# EAGLE design current_driver (EAGLE 8.3.2)
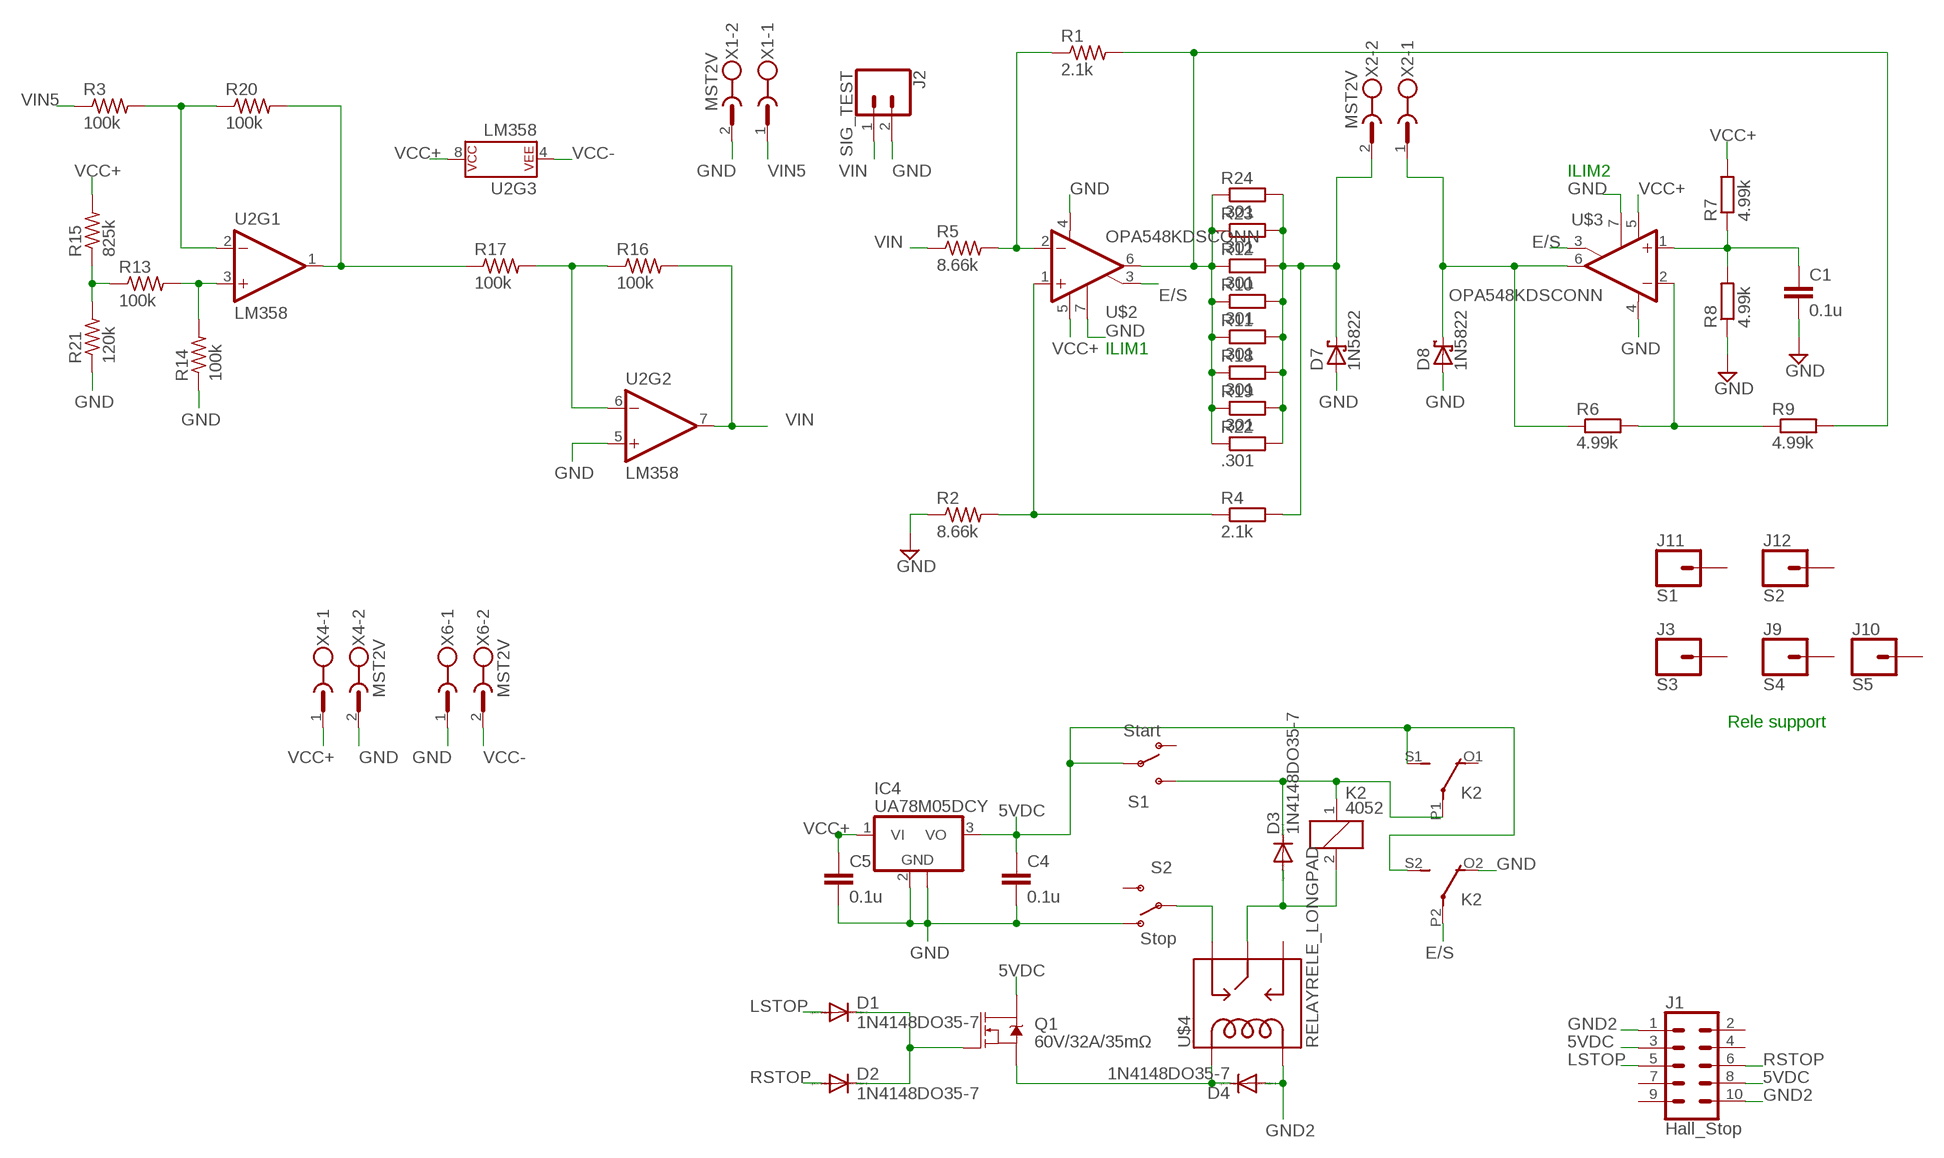
[diagram p0: schematic, sheet 1]

## Parts
C1  0.1u  C-EUC2012  [C2012]
C4  0.1u  C-EUC2012  [C2012]
C5  0.1u  C-EUC2012  [C2012]
D1  1N4148DO35-7  [DO35-7]
D2  1N4148DO35-7  [DO35-7]
D3  1N4148DO35-7  [DO35-7]
D4  1N4148DO35-7  [DO35-7]
D7  1N5822  SCHOTTKY-DIODEF126Z12  [F126Z12]
D8  1N5822  SCHOTTKY-DIODEF126Z12  [F126Z12]
IC4  UA78M05DCY  [SOT223]
J1  Hall_Stop  CONN_05X2SHD_LOCK  [2X5-SHROUDED_LOCK]
J2  SIG_TEST  CONN_02LOCK_LONGPADS  [1X02_LOCK_LONGPADS]
J3  S3  CONN_01PTH_LONGPAD  [1X01_LONGPAD]
J9  S4  CONN_01PTH_LONGPAD  [1X01_LONGPAD]
J10  S5  CONN_01PTH_LONGPAD  [1X01_LONGPAD]
J11  S1  CONN_01PTH_LONGPAD  [1X01_LONGPAD]
J12  S2  CONN_01PTH_LONGPAD  [1X01_LONGPAD]
K2  4052  [F4052]
Q1  60V/32A/35mΩ  MOSFET-NCH-FQP30N06L  [TO220V]
R1  2.1k  R-US_R0805  [R0805]
R2  8.66k  R-US_R0805  [R0805]
R3  100k  R-US_R0805  [R0805]
R4  2.1k  R-EU_R0805  [R0805]
R5  8.66k  R-US_R0805  [R0805]
R6  4.99k  R-EU_R0805  [R0805]
R7  4.99k  R-EU_R0805  [R0805]
R8  4.99k  R-EU_R0805  [R0805]
R9  4.99k  R-EU_R0805  [R0805]
R10  .301  R-EU_M1206  [M1206]
R11  .301  R-EU_M1206  [M1206]
R12  .301  R-EU_M1206  [M1206]
R13  100k  R-US_R0805  [R0805]
R14  100k  R-US_R0805  [R0805]
R15  825k  R-US_R0805  [R0805]
R16  100k  R-US_R0805  [R0805]
R17  100k  R-US_R0805  [R0805]
R18  .301  R-EU_M1206  [M1206]
R19  .301  R-EU_M1206  [M1206]
R20  100k  R-US_R0805  [R0805]
R21  120k  R-US_R0805  [R0805]
R22  .301  R-EU_M1206  [M1206]
R23  .301  R-EU_M1206  [M1206]
R24  .301  R-EU_M1206  [M1206]
S1  Start  SWITCH-SPDTSMD  [SWITCH_SPDT_SMD]
S2  Stop  SWITCH-SPDTSMD  [SWITCH_SPDT_SMD]
U2  LM358  LM358DIP08_LONGPAD  [DIP08_LONGPAD]
U$2  OPA548KDSCONN  [OPA548KDSCONN]
U$3  OPA548KDSCONN  [OPA548KDSCONN]
U$4  RELAYRELE_LONGPAD  [RELE_LONGPAD]
X1  MST2V  [MSTBV2]
X2  MST2V  [MSTBV2]
X4  MST2V  [MSTBV2]
X6  MST2V  [MSTBV2]

## Nets
5VDC: C4.1 IC4.3(VO) J1.3 J1.8 K2.S1(2:S) K2.S2(3:S) Q1.2(D) S1.2(P)
E/S: K2.P2(3:P) U$2.3(ILIM) U$3.3(ILIM)
GND: C1.2 C4.2 C5.2 D7.A D8.A IC4.2(GND) IC4.4(GND) J2.2 K2.O2(3:O) R2.1 R8.1 R14.1 R21.1 S2.1(O) U2.5(+IN) U$2.4(V-) U$2.7(E/S) U$3.4(V-) U$3.7(E/S) X1.2 X4.2 X6.1
GND2: D4.A J1.1 J1.10 U$4.COIL0
LSTOP: D1.A J1.5
N$2: R1.1 R5.2 U$2.2(-IN)
N$3: D7.C R4.2 R10.2 R11.2 R12.2 R18.2 R19.2 R22.2 R23.2 R24.2 X2.2
N$4: R2.2 R4.1 U$2.1(+IN)
N$5: D8.C R6.1 U$3.6(OUT) X2.1
N$6: R6.2 R9.1 U$3.2(-IN)
N$7: C1.1 R7.1 R8.2 U$3.1(+IN)
N$8: D3.C K2.1 K2.P1(2:P) S1.3(S)
N$9: D4.C Q1.3(S) U$4.COIL1
N$10: D3.A K2.2 U$4.SWCOMMON
N$11: S2.2(P) U$4.SWCLOSED(SWCLOSE)
N$12: R17.1 R20.2 U2.1(OUT)
N$13: R3.2 R20.1 U2.2(-IN)
N$14: R13.2 R14.2 U2.3(+IN)
N$15: R13.1 R15.1 R21.2
N$16: D1.C D2.C Q1.1(G)
N$17: R16.1 R17.2 U2.6(-IN)
N$19: R1.2 R9.2 R10.1 R11.1 R12.1 R18.1 R19.1 R22.1 R23.1 R24.1 U$2.6(OUT)
RSTOP: D2.A J1.6
VCC+: C5.1 IC4.1(VI) R7.2 R15.2 U2.8(P$V+) U$2.5(V+) U$3.5(V+) X4.1
VCC-: U2.4(P$V-) X6.2
VIN: J2.1 R5.1 R16.2 U2.7(OUT)
VIN5: R3.1 X1.1
Unconnected: J1.2 J1.4 J1.7 J1.9 J3.1 J9.1 J10.1 J11.1 J12.1 K2.O1(2:O) S1.1(O) S2.3(S) U$4.SWOPEN

## Notes on the sheet
- ILIM2
- ILIM1
- Rele support

## Library data of the parts
C1 C4 C5 = rcl:C-EU: CAPACITOR, European symbol
D1-D4 = diode:1N4148: DIODE high speed (Philips)
D7 D8 = diode:SCHOTTKY-DIODE: Schottky Diode
IC4 = linear:UA78M*: POSITIVE-VOLTAGE REGULATORS Source: http://focus.ti.com/lit/ds/symlink/ua78m33.pdf
J1 = SparkFun-Connectors:CONN_05X2: Multi connection point. Often used as Generic Header-pin footprint for 0.1 inch spaced/style header connections For AVR SPI programming port, see special device with nice symbol: "AVR_SPI_PROG_5x2.dev" You can populate with any combo of single row headers, but if you'd like an exact match, check these: 2x5 AVR ICSP Male Header <https://www.sparkfun.com/products/778> (PRT-00778) 2x5 Pin Shrouded Header <https://www.sparkfun.com/products/8506> (PRT-08506) On any of the 0.1 inch spaced packages, you can populate with these: Break Away Headers - Straight <https://www.sparkfun.com/products/116> (PRT-00116) Break Away Male Headers - Right Angle <https://www.sparkfun.com/products/553> (PRT-00553) Female Headers <https://www.sparkfun.com/products/115> (PRT-00115) Break Away Headers - Machine Pin <https://www.sparkfun.com/products/117> (PRT-00117) Break Away Female Headers - Swiss Machine Pin <https://www.sparkfun.com/products/743> (PRT-00743) Special note: the shrouded connector mates well with our 5x2 ribbon cables: 2x5 Pin IDC Ribbon Cable <https://www.sparkfun.com/products/8535> (PRT-08535); PROD_ID: CONN-08671; SF_ID: PRT-08506
J2 = SparkFun-Connectors:CONN_02: Multi connection point. Often used as Generic Header-pin footprint for 0.1 inch spaced/style header connections On any of the 0.1 inch spaced packages, you can populate with these: Break Away Headers - Straight <https://www.sparkfun.com/products/116> (PRT-00116) Break Away Male Headers - Right Angle <https://www.sparkfun.com/products/553> (PRT-00553) Female Headers <https://www.sparkfun.com/products/115> (PRT-00115) Break Away Headers - Machine Pin <https://www.sparkfun.com/products/117> (PRT-00117) Break Away Female Headers - Swiss Machine Pin <https://www.sparkfun.com/products/743> (PRT-00743) For SCREWTERMINALS and SPRING TERMINALS visit here: Screw Terimnals on SparkFun.com <https://www.sparkfun.com/search/results?term=Screw+Terminals> (5mm/3.5mm/2.54mm spacing) This device is also useful as a general connection point to wire up your design to another part of your project. Our various solder wires solder well into these plated through hole pads. Hook-Up Wire - Assortment (Stranded, 22 AWG) <https://www.sparkfun.com/products/11375> (PRT-11375) Hook-Up Wire - Assortment (Solid Core, 22 AWG) <https://www.sparkfun.com/products/11367> (PRT-11367) View the entire wire category on our website here <https://www.sparkfun.com/categories/141> Special notes: Molex polarized connector foot print use with: PRT-08233 with associated crimp pins and housings. 2.54_SCREWTERM for use with PRT-10571. 3.5mm Screw Terminal footprints for PRT-08084 5mm Screw Terminal footprints for use with PRT-08432
J3 J9-J12 = SparkFun-Connectors:CONN_01: Single connection point. Often used as Generic Header-pin footprint for 0.1 inch spaced/style header connections On any of the 0.1 inch spaced packages, you can populate with these: Break Away Headers - Straight <https://www.sparkfun.com/products/116> (PRT-00116) Break Away Male Headers - Right Angle <https://www.sparkfun.com/products/553> (PRT-00553) Female Headers <https://www.sparkfun.com/products/115> (PRT-00115) Break Away Headers - Machine Pin <https://www.sparkfun.com/products/117> (PRT-00117) Break Away Female Headers - Swiss Machine Pin <https://www.sparkfun.com/products/743> (PRT-00743) This device is also useful as a general connection point to wire up your design to another part of your project. Our various solder wires solder well into these plated through hole pads. Hook-Up Wire - Assortment (Stranded, 22 AWG) <https://www.sparkfun.com/products/11375> (PRT-11375) Hook-Up Wire - Assortment (Solid Core, 22 AWG) <https://www.sparkfun.com/products/11367> (PRT-11367) View the entire wire category on our website here <https://www.sparkfun.com/categories/141> Special notes: SMTSO-256-ET is a "flush mount" nut for a 4-40 screw. We mostly use this on specialty testbeds; it is a nice way to connect hardware to your PCB at an adjustable hieght. Also note, the SNAP packages are for using a snappable style connector. We sell a baggie of snaps and they are also used on two LilyPad designs: Snap Assortment - 30 pack (male and female) <https://www.sparkfun.com/products/11347> (DEV-11347) LilyPad Arduino SimpleSnap <https://www.sparkfun.com/products/10941> (DEV-10941) LilyPad SimpleSnap Protoboard <https://www.sparkfun.com/products/10940> (DEV-10940)
K2 = relay:4052: RELAY 2 x switch, Finder; OC_FARNELL: unknown; OC_NEWARK: unknown
Q1 = SparkFun-DiscreteSemi:MOSFET-NCH: N-channel MOSFETs Voltage controlled devices that allow control of high current outputs. SparkFun Products: SparkFun OpenScale <https://www.sparkfun.com/products/13261> SparkFun Digital Sandbox <https://www.sparkfun.com/products/12651> SparkFun Monster Moto Shield <https://www.sparkfun.com/products/10182> SparkFun MOSFET Power Controller <https://www.sparkfun.com/products/11214>; PROD_ID: TRANS-10060
R1-R3 R5 R13-R17 R20 R21 = resistor:R-US_: RESISTOR, American symbol
R4 R6-R9 = resistor:R-EU_: RESISTOR, European symbol
R10-R12 R18 R19 R22-R24 = rcl:R-EU_: RESISTOR, European symbol
S1 S2 = SparkFun-Retired:SWITCH-SPDT: SPDT Switch Simple slide switch, Spark Fun Electronics SKU : COM-00102 DPDT SMT slide switch, AYZ0202, SWCH-08179
U2 = SparkFun-IC-Amplifiers:LM358: LM358 Jellybean op-amp Datasheet <http://www.sparkfun.com/datasheets/Components/General/LM358.pdf> SparkFun Products Op-Amp (Thru-Hole) - LM358 <https://www.sparkfun.com/products/9456> (COM-09456)
U$2 U$3 = opa548-kds:OPA548KDSCONN: OPA548 KDS03 AND KDS04 CONNECTORS
U$4 = SRD-05VDC-SL-C:RELAY: SPDT relay (COM-00101)
X1 X2 X4 X6 = con-phoenix-508:MST2V: PHOENIX; OC_FARNELL: unknown; OC_NEWARK: unknown

## Board
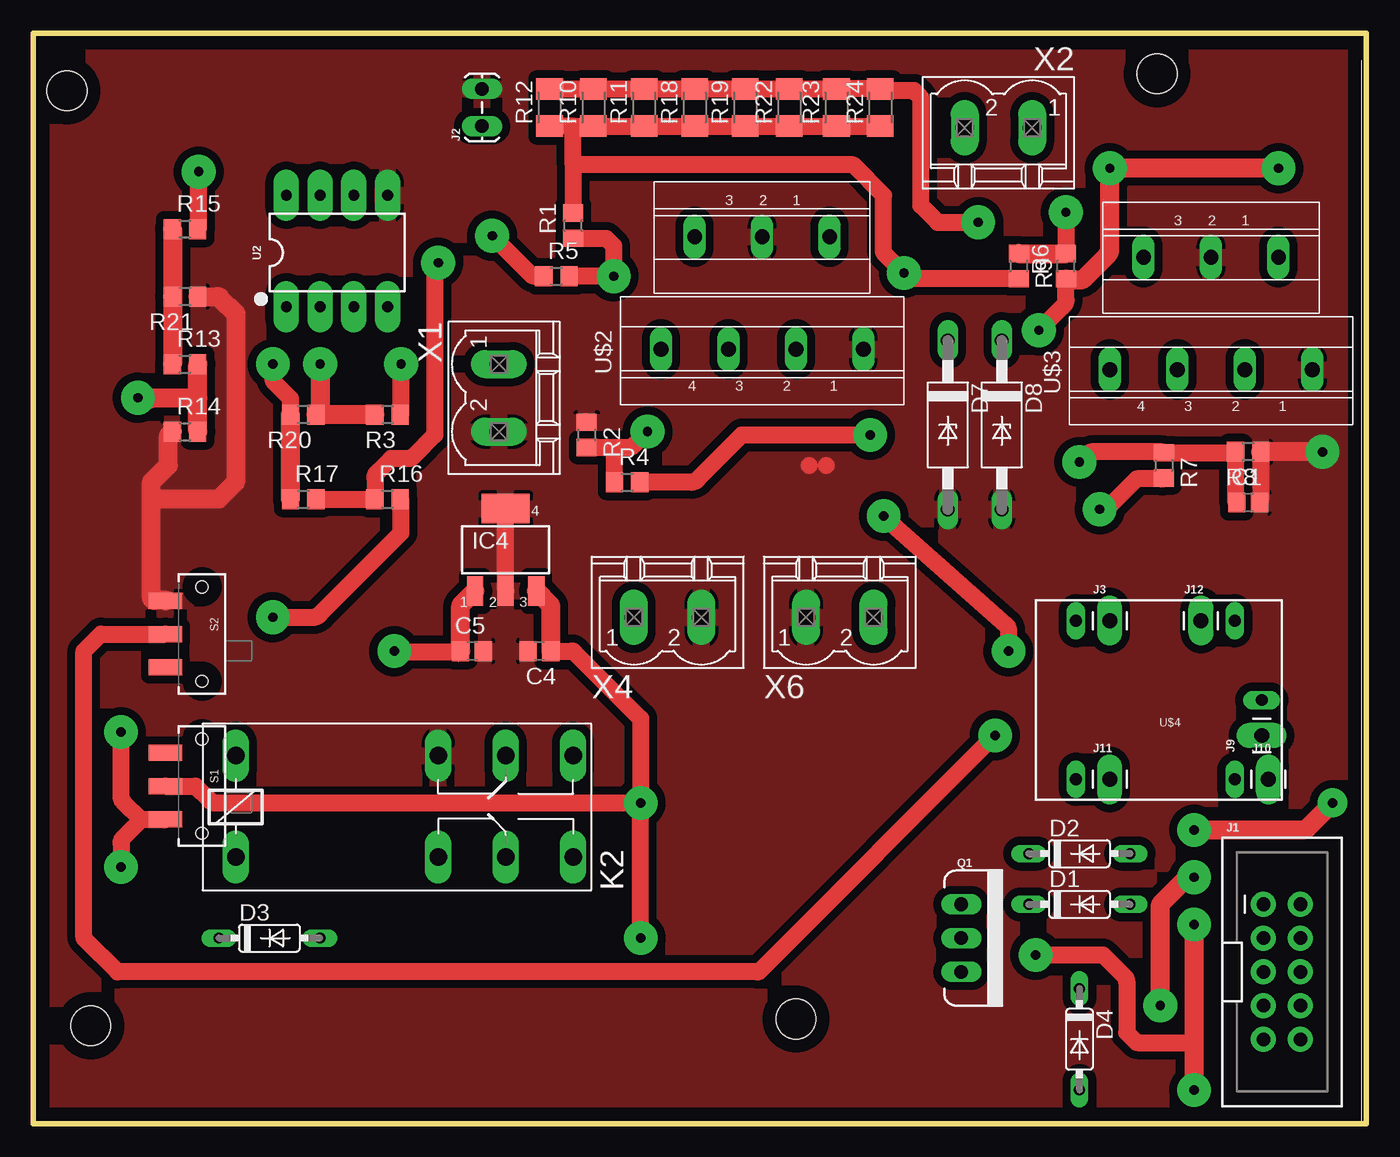
[diagram p1: board, top side]
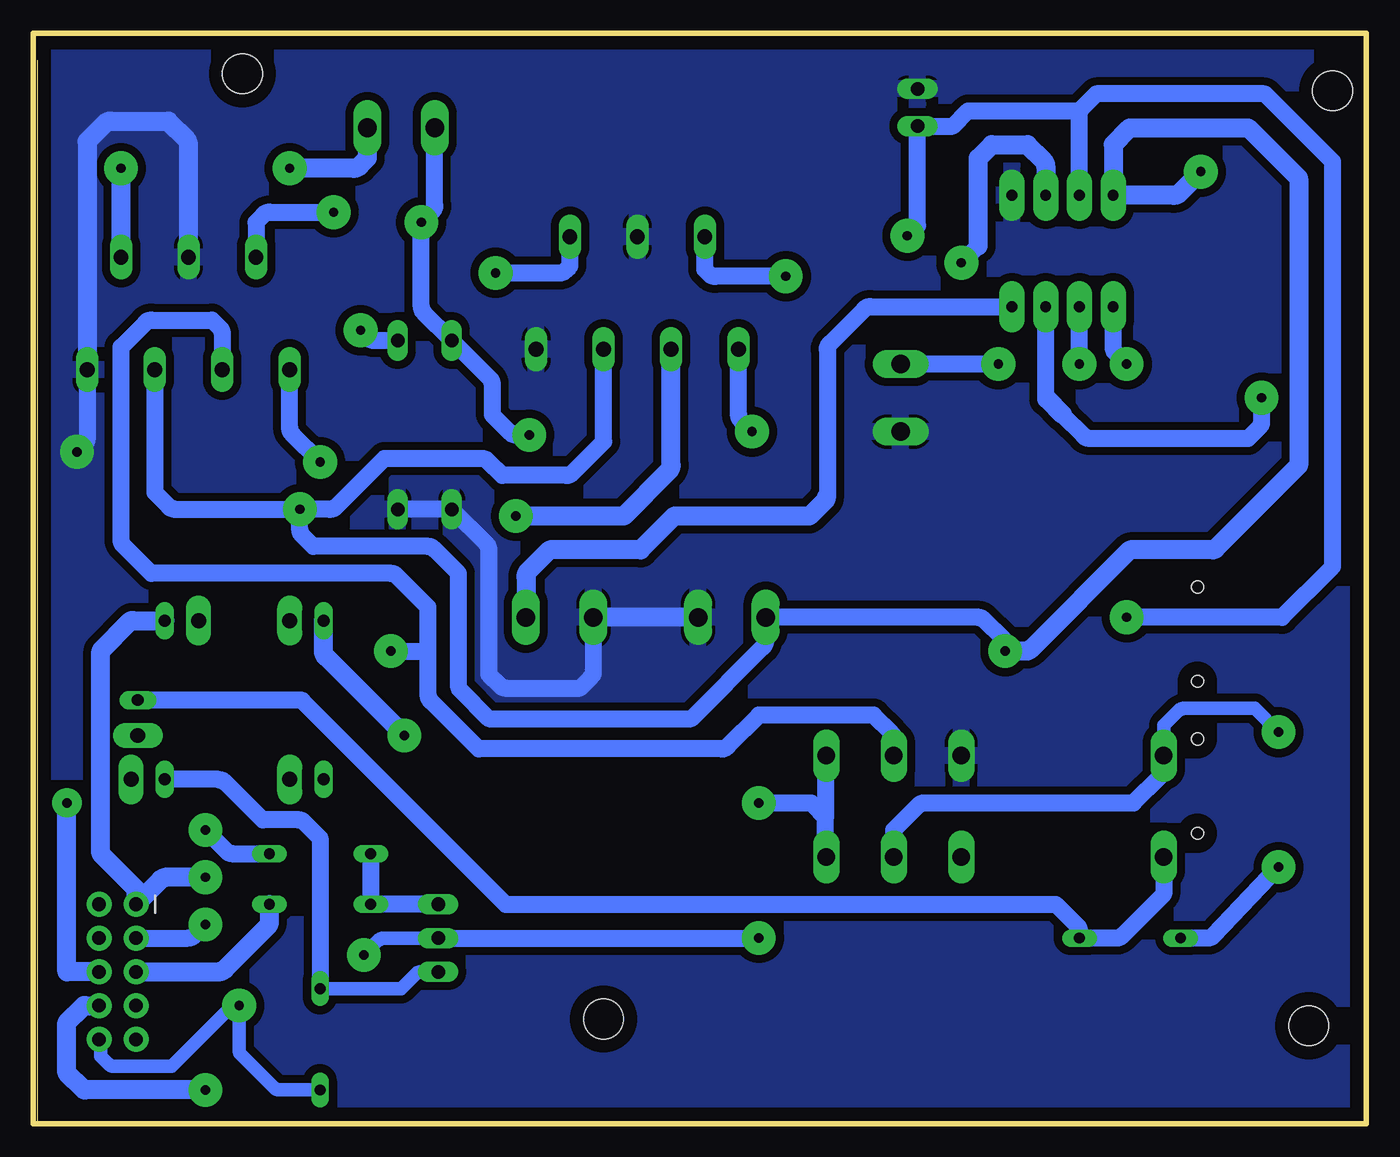
[diagram p2: board, bottom side, seen from below]

Size 100.33 x 82.04 mm. Coordinates in mm from the lower left corner, seen from the top.
Outline: 0,0 100,0 100,80
Outline: 0,80 0,0
Outline: 0,0 0,82.04 100.33,82.04 100.33,0 0,0
Copper layers (1*16): Top 0.035mm / dielectric 1.5mm / Bottom 0.035mm
Design rules "default": minimum track width 10mil, minimum drill 24mil, track to track 8mil, track to pad 8mil, pad to pad 8mil, via to via 8mil, smd to smd 8mil, copper to edge 40mil, drill to drill 8mil, minimum pad ring 10mil, minimum via ring 8mil, stop-mask expansion 4mil, vias tented up to drill 0mil, thermal gap 10mil
Holes 3 mm at 2.54,77.72 84.58,78.99 4.32,7.37 57.4,7.87

### Footprints (pad centres in the part's own frame; a part is rotated, then mirrored left to right if it is on the bottom)
C2012 = smd 1.3 x 1.5: 1 -0.85,0; 2 0.85,0
DO35-7 = drill 0.813 long: A 3.81,0; C -3.81,0
F126Z12 = drill 1.016 long: A 6.35,0; C -6.35,0
SOT223 = smd 1.219 x 2.235: 1 -2.311,-3.099; 2 0,-3.099; 3 2.311,-3.099 | smd 3.6 x 2.2: 4 0,3.099
2X5-SHROUDED_LOCK = drill 1.016 pad 1.88: 1 -1.397,5.08; 2 1.397,5.08; 3 -1.397,2.54; 4 1.397,2.54; 5 -1.397,0; 6 1.397,0; 7 -1.397,-2.54; 8 1.397,-2.54; 9 -1.397,-5.08; 10 1.397,-5.08
1X02_LOCK_LONGPADS = drill 1.016 long: 1 -0.127,0; 2 2.667,0
1X01_LONGPAD = drill 1.118 pad 1.88 long: 1 0,0
F4052 = drill 1.321 long: 1 -3.81,3.81; 2 -3.81,-3.81; O1 11.43,-3.81; O2 11.43,3.81; P1 16.51,-3.81; P2 16.51,3.81; S1 21.59,-3.81; S2 21.59,3.81
TO220V = drill 1.016 long: 1 -2.54,0; 2 0,0; 3 2.54,0
R0805 = smd 1.3 x 1.5: 1 -0.95,0; 2 0.95,0
M1206 = smd 1.6 x 2: 1 -1.4,0; 2 1.4,0
SWITCH_SPDT_SMD = smd 1.2 x 2.5: 1 -2.5,-2.75; 2 0,-2.75; 3 2.5,-2.75 | hole 0.9: -3.55,0; 3.55,0
DIP08_LONGPAD = drill 0.8 pad 1.93 long: 1 -3.81,-4.064; 2 -1.27,-4.064; 3 1.27,-4.064; 4 3.81,-4.064; 5 3.81,4.318; 6 1.27,4.318; 7 -1.27,4.318; 8 -3.81,4.318
OPA548KDSCONN = drill 1.118 pad 1.626 long: 1 -7.62,-1.686; 2 -5.08,6.78; 3 -2.54,-1.686; 4 0,6.78; 5 2.54,-1.686; 6 5.08,6.78; 7 7.62,-1.686
RELE_LONGPAD = drill 0.9 long: COIL0 -5.334,-6.096; COIL1 -5.334,5.842; SWCLOSED 6.604,-6.096; SWCOMMON -7.366,-0.127; SWOPEN 6.604,5.842
MSTBV2 = drill 1.397 long: 1 -2.54,0; 2 2.54,0

### Placement (x,y rotation side)
C1  91.44,46.74 0 top
C4  38.1,35.56 180 top
C5  33.02,35.56 0 top
D1  78.74,16.51 0 top
D2  78.74,20.32 0 top
D3  17.78,13.97 0 top
D4  78.74,6.35 270 top
D7  68.83,52.58 270 top
D8  72.9,52.58 270 top
IC4  35.56,43.18 0 top
J1  93.98,11.43 0 top
J2  33.78,75.18 90 top
J3  81.03,37.85 0 top
J9  92.46,29.21 90 top
J10  92.96,25.91 0 top
J11  81.03,25.91 0 top
J12  87.88,37.85 0 top
K2  19.05,23.88 0 top
Q1  69.85,13.97 270 top
R1  40.64,67.56 90 top
R2  41.66,51.82 270 top
R3  26.67,53.34 180 top
R4  44.7,48.26 0 top
R5  39.37,63.75 0 top
R6  77.72,64.52 90 top
R7  85.09,49.53 270 top
R8  91.44,50.55 180 top
R9  74.17,64.52 270 top
R10  42.16,76.45 90 top
R11  45.97,76.45 90 top
R12  38.86,76.45 90 top
R13  11.43,57.15 0 top
R14  11.43,52.07 0 top
R15  11.43,67.31 0 top
R16  26.67,46.99 0 top
R17  20.32,46.99 0 top
R18  49.78,76.45 90 top
R19  53.59,76.45 90 top
R20  20.32,53.34 180 top
R21  11.43,62.23 180 top
R22  56.9,76.45 90 top
R23  60.45,76.45 90 top
R24  63.75,76.45 90 top
S1  12.7,25.4 270 top
S2  12.7,36.83 270 top
U2  22.86,65.53 0 top
U$2  54.86,59.94 0 top
U$3  88.65,58.42 0 top
U$4  85.09,31.75 180 top
X1  35.05,54.61 270 top
X2  72.64,74.93 180 top
X4  47.75,38.1 0 top
X6  60.71,38.1 0 top

### Tracks (layer width: path | path; a pad name or v marks a point on that pad's centre or on a via)
5VDC  (via drill 0.7 pad 2.54)
  Top 1.27: C4.1 40.53,35.56 arc-45 40.71,35.49 45.72,30.48 v45.72,24.13 | v45.72,13.97 v45.72,24.13 | S1.2 12.19,25.4 13.28,24.32 arc45 13.72,24.13 v45.72,24.13 | 87.38,6.1 83.16,6.1 arc-45 82.98,6.17 82.3,6.86 82.3,10.66 arc45 82.11,11.11 80.52,12.7 v75.44,12.7
  Top 1.422: IC4.3 38.88,39.08 arc-45 38.95,38.9 C4.1 | v87.38,2.54 87.38,6.1 v87.38,14.99
  Bottom 1.016: Q1.2 73.91,13.97 arc-45 74.35,13.78 v75.44,12.7
  Bottom 1.27: v45.72,24.13 41.87,24.13 arc45 41.69,24.06 40.69,23.06 | Q1.2 v45.72,13.97 | K2.S2 arc-90 40.69,27.63 40.69,23.06 | K2.S1 arc90 40.69,20.12 40.69,23.06 | J1.3 88.66,13.97 arc-45 88.21,14.16 v87.38,14.99
  Bottom 1.422: v87.38,2.54 96.42,2.54 arc45 96.59,2.61 97.79,3.81 97.79,7.62 96.59,8.82 arc45 96.42,8.89 J1.8
E/S  (via drill 0.7 pad 2.54)
  Top 1.27: v73.41,35.56 73.41,37.08 arc45 73.22,37.52 v64.01,45.72
  Bottom 1.27: 70.61,35.56 70.61,32.27 arc-45 70.43,31.82 66.8,28.19 48.52,28.19 arc-45 48.07,28.38 45.72,30.73 37.08,30.73 35.75,29.4 arc45 35.56,28.95 K2.P2 | 70.61,35.56 70.61,38.86 72.97,41.22 arc-45 73.42,41.4 91.44,41.4 93.54,43.5 arc45 93.73,43.95 93.73,58.42 91.88,60.27 arc45 91.43,60.45 86.87,60.45 86.29,59.88 arc45 86.11,59.43 U$3.3 | v73.41,35.56 70.61,35.56
  Bottom 1.422: U$2.3 52.32,49.54 arc45 52.51,49.09 55.88,45.72 v64.01,45.72
GND  (via drill 0.7 pad 2.54)
  Top 1.27: R8.1 92.39,46.94 | IC4.2 IC4.4 | R2.1 41.59,52.83 | 58.42,49.53 arc-63 58.42,49.53 | 59.69,49.53 arc-63 59.69,49.53
  Top 1.422: S2.1 arc-45 10.05,39.37 9.14,39.37 arc-90 8.89,39.62 8.89,46.99 | 8.89,46.99 8.89,48.26 10.16,49.53 10.16,51.65 arc-45 10.23,51.82 R14.1 | R21.1 13.87,62.23 arc-45 14.04,62.16 15.24,60.96 15.24,48.37 arc-45 15.17,48.19 13.97,46.99 8.89,46.99 | v97.03,50.55 R8.1
  Bottom 1.27: X6.1 58.17,34.05 arc45 58.35,33.6 59.18,32.77 64.76,32.77 arc45 65.21,32.95 66.04,33.78 66.04,43.17 arc-45 66.23,43.62 D7.A D8.A | U$3.7 96.27,51.57 arc45 96.45,51.12 v97.03,50.55
  Bottom 1.422: U$3.7 96.27,73.91 94.93,75.25 arc45 94.48,75.44 90.17,75.44 88.83,74.1 arc45 88.65,73.65 U$3.4 | X4.2 X6.1
  pour Bottom (isolate 0.61): 0,81.79 100.33,81.79 100.33,0 0,0
  pour Top (isolate 0.61): 0,81.79 100.33,81.79 100.33,0 0,0
GND2  (via drill 0.7 pad 2.54)
  Top 1.422: v84.84,8.89 84.84,16.51 86.68,18.36 arc-45 87.13,18.54 v87.38,18.54
  Bottom 1.016: J1.10 arc45 95.25,6.04 95.25,5.08 94.67,4.5 arc-45 94.22,4.32 89.92,4.32 85.53,8.7 arc45 85.08,8.89 v84.84,8.89 84.84,5.6 arc-45 84.65,5.15 82.23,2.73 arc-45 81.78,2.54 D4.A
  Bottom 1.27: J1.1 92.31,16.51
  Bottom 1.422: v87.38,18.54 90.29,18.54 arc-45 90.74,18.36 J1.1 92.58,17.55 arc-45 92.66,17.73 95.25,20.32 95.25,35.56 93.01,37.8 arc45 92.83,37.87 arc-45 92.78,37.85 U$4.COIL0
LSTOP
  Bottom 1.422: J1.5 86.37,11.43 arc-45 85.92,11.62 82.74,14.8 arc-45 82.55,15.25 D1.A
N$2  (via drill 0.7 pad 2.54)
  Top 1.27: R5.2 v43.69,63.75 43.69,66.04 43.11,66.61 R1.1
  Bottom 1.27: v43.69,63.75 49.01,63.75 arc45 49.46,63.94 49.78,64.26 U$2.2
N$3  (via drill 0.7 pad 2.54)
  Top 1.27: v62.99,51.82 53.34,51.82 49.97,48.45 arc-45 49.52,48.26 R4.2 | v71.12,67.82 68.07,67.82 66.8,69.09 66.8,77.22 66.29,77.72 63.88,77.72 R24.2 R23.2 R22.2 R19.2 R18.2 R11.2 R10.2 R12.2
  Bottom 1.27: X2.2 70.1,69.1 arc45 70.29,68.65 v71.12,67.82 71.12,61.48 arc-45 70.93,61.03 D7.C 65.97,56.07 arc45 65.79,55.62 65.79,53.35 64.44,52 arc-45 63.99,51.82 v62.99,51.82
N$4  (via drill 0.7 pad 2.54)
  Top 1.27: 43.86,50.8 arc-45 43.68,50.87 | R4.1 43.75,50.7 arc45 43.68,50.87 | 43.68,50.87 43.18,50.87 | 43.18,50.87 R2.2 | v46.23,52.07 45.22,51.06 arc-45 44.77,50.87 43.18,50.87
  Bottom 1.27: v46.23,52.07 47.06,52.9 arc45 47.24,53.35 U$2.1
N$5  (via drill 0.7 pad 2.54)
  Top 1.27: v75.69,59.69 77.54,61.54 arc45 77.72,61.98 R6.1
  Top 1.422: v93.73,71.88 v81.03,71.88 81.03,65.8 arc-45 80.84,65.35 78.99,63.5 77.88,63.5 arc-45 R6.1
  Bottom 1.27: v75.69,59.69 75.12,59.11 arc-45 74.67,58.93 D8.C
  Bottom 1.422: U$3.6 v93.73,71.88 | X2.1 75.18,72.64 75.76,72.07 arc45 76.21,71.88 v81.03,71.88
N$6  (via drill 0.7 pad 2.54)
  Top 1.27: v77.72,68.58 R6.2
  Top 1.422: R9.1 R6.2
  Bottom 1.27: U$3.2 83.57,67.82 82.99,68.39 arc45 82.54,68.58 v77.72,68.58
N$7  (via drill 0.7 pad 2.54)
  Top 1.27: C1.1 90.56,46.76 arc-45 90.49,46.94 R8.2 arc-45 90.33,50.48 R7.1 arc45 84.93,50.55 79.77,50.55 arc45 79.32,50.36 v78.74,49.78
  Bottom 1.27: U$3.1 81.03,52.33 arc-45 80.84,51.88 v78.74,49.78
N$8  (via drill 0.7 pad 2.54)
  Top 1.27: S1.3 arc-45 9.85,22.86 8.13,22.86 | 8.13,22.86 6.79,24.2 arc-45 6.6,24.65 v6.6,29.46 | 8.13,22.86 6.79,21.52 arc45 6.6,21.07 v6.6,19.3
  Bottom 1.016: K2.1 15.24,29.97 14.16,31.06 arc45 13.71,31.24 8.38,31.24 v6.6,29.46
  Bottom 1.27: K2.P1 35.56,22.1 33.71,23.94 arc45 33.27,24.13 17.53,24.13 15.43,26.23 | 15.43,26.23 arc-45 15.24,26.68 | 15.24,26.68 K2.1 | v6.6,19.3 11.5,14.16 arc45 11.95,13.97 D3.C | 15.43,26.23 arc-45 15.24,26.68
N$9
  Bottom 1.016: Q1.3 71.11,11.43 arc-45 71.56,11.24 72.64,10.16 D4.C
  Bottom 1.27: U$4.COIL1 86.42,25.91 arc45 86.33,25.87 arc45 85.88,25.68 83.06,22.86 80.38,22.86 arc45 79.93,22.67 78.74,21.48 D4.C
N$10
  Bottom 1.27: K2.2 15.24,17.27 18.36,14.16 arc45 18.8,13.97 D3.A 21.59,14.47 arc-45 21.78,14.92 23.37,16.51 64.77,16.51 80.06,31.8 arc-45 80.23,31.87 arc-45 80.25,31.88 U$4.SWCOMMON
N$11  (via drill 0.7 pad 2.54)
  Top 1.27: S2.2 5.08,36.83 3.88,35.63 arc45 3.81,35.45 3.81,14.07 arc45 3.88,13.9 6.35,11.43 54.51,11.43 arc45 54.68,11.5 v72.39,29.21
  Bottom 1.422: v72.39,29.21 78.3,35.12 arc45 78.49,35.57 U$4.SWCLOSED
N$12  (via drill 0.7 pad 2.54)
  Top 1.27: R20.2 19.37,54.45 arc45 19.3,54.61 18.22,55.69 arc-45 18.03,56.14 v18.03,57.15
  Top 1.422: R17.1 R20.2
  Bottom 1.27: v18.03,57.15 18.86,57.98 arc45 19.05,58.43 U2.1
N$13  (via drill 0.7 pad 2.54)
  Top 1.422: R3.2 21.59,53.34 | v21.59,57.15 21.59,53.34 | 21.59,53.34 R20.1
  Bottom 1.27: v21.59,57.15 U2.2
N$14  (via drill 0.7 pad 2.54)
  Top 1.422: R14.2 12.38,54.61 | 12.38,54.61 R13.2 | v7.87,54.61 8.82,54.54 arc-45 8.99,54.61 12.38,54.61
  Bottom 1.27: 22.86,53.34 21.27,51.75 arc-45 20.82,51.56 8.89,51.56 8.06,52.39 arc-45 7.87,52.84 v7.87,54.61 | 24.06,54.54 arc45 24.13,54.72 U2.3
  Bottom 1.422: 24.06,54.54 22.86,53.34
N$15
  Top 1.422: R15.1 R21.2 R13.1
N$16
  Bottom 1.27: Q1.1 D1.C D2.C
N$17  (via drill 0.7 pad 2.54)
  Top 1.27: R17.2 R16.1 25.72,48.57 arc-45 25.91,49.02 26.92,50.04 28.18,50.04 arc45 28.63,50.22 30.23,51.82 30.23,64.25 arc-45 30.41,64.7 v30.48,64.77
  Bottom 1.27: v30.48,64.77 29.21,66.04
  Bottom 1.422: U2.6 24.13,72.02 arc-45 24.32,72.47 25.5,73.66 28.19,73.66 29.21,72.64 29.21,66.04
N$19  (via drill 0.7 pad 2.54)
  Top 1.27: 40.64,75.05 R12.1 | 40.64,75.05 R10.1 R11.1 R18.1 R19.1 R22.1 R23.1 R24.1 | 40.64,72.14 R1.2 | 40.64,72.14 40.64,75.05 | R9.2 65.97,63.57 v65.53,64.01 64.01,65.53 64.01,69.85 61.72,72.14 40.64,72.14
  Bottom 1.27: v65.53,64.01 60.72,64.01 arc-45 60.27,64.19 59.94,64.52 U$2.6
RSTOP  (via drill 0.7 pad 2.18, 0.7 pad 2.54)
  Top 1.422: v87.38,22.1 95.5,22.1 arc45 95.94,22.28 v97.79,24.13
  Bottom 1.27: v87.38,22.1 85.78,20.51 arc-45 85.33,20.32 D2.A
  Bottom 1.422: J1.6 97.79,11.43 v97.79,24.13
VCC+  (via drill 0.7 pad 2.54)
  Top 1.27: 31.99,35.49 27.36,35.49 arc-45 v27.18,35.56 | R7.2 arc-45 84.93,48.51 83.06,48.51 80.96,46.41 arc-45 80.51,46.23 v80.26,46.23 | R15.2 arc45 12.45,67.47 v12.45,71.63
  Top 1.422: IC4.1 32.24,39.08 arc45 32.17,38.9 C5.1 arc-45 31.99,35.49
  Bottom 1.27: U$2.5 57.4,51.32 59.77,48.95 arc45 60.22,48.77 65.02,48.77 66.11,49.85 arc-45 66.56,50.04 73.91,50.04 77.54,46.41 arc45 77.99,46.23 v80.26,46.23 | v27.18,35.56 27.18,36.06 arc-45 27.36,36.51 28.77,37.91 arc-45 29.22,38.1 X4.1 45.21,36.33 arc45 45.4,35.88 50.8,30.48 66.04,30.48 68.14,32.58 arc45 68.33,33.03 68.33,41.4 70.17,43.25 arc-45 70.62,43.43 79.25,43.43 80.08,44.26 arc45 80.26,44.71 v80.26,46.23 | U$3.5 91.19,47.5 90.1,46.41 arc-45 89.65,46.23 v80.26,46.23
  Bottom 1.422: v27.18,35.56 25.66,35.56 arc-45 25.21,35.75 17.78,43.18 11.54,43.18 arc-45 11.36,43.25 5.08,49.53 5.08,71.02 arc-45 5.15,71.19 8.89,74.93 17.68,74.93 arc-45 17.85,74.86 19.05,73.66 U2.8 14.49,69.85 arc-45 14.04,70.04 v12.45,71.63
VCC-
  Bottom 1.27: 40.64,47.09 arc-90 40.57,47.17 40.57,58.23 arc45 40.38,58.68 37.78,61.28 arc45 37.33,61.47 U2.4
  Bottom 1.422: 40.64,47.09 arc45 40.71,46.92 41.91,45.72 51.97,45.72 arc-45 52.14,45.65 54.61,43.18 61.47,43.18 63.06,41.59 arc-45 63.25,41.14 X6.2
VIN  (via drill 0.7 pad 2.54)
  Top 1.27: v18.03,38.1 21.07,38.1 arc45 21.52,38.29 27.69,44.45 27.69,46.83 arc45 R16.2 | v34.54,66.8 37.41,63.94 arc45 37.85,63.75 R5.1
  Bottom 1.27: 21.52,76.27 20.32,77.47 7.72,77.47 arc45 7.55,77.4 2.54,72.39 2.54,42.02 arc45 2.61,41.84 6.35,38.1 v18.03,38.1 | U2.7 21.59,76.09 arc45 21.52,76.27 | v34.54,66.8 33.78,67.56 J2.1 31.11,75.06 29.97,76.2 21.59,76.2 21.52,76.27
VIN5  (via drill 0.7 pad 2.54)
  Top 1.27: R3.1 arc45 27.69,53.5 v27.69,57.15
  Bottom 1.27: v27.69,57.15 X1.1